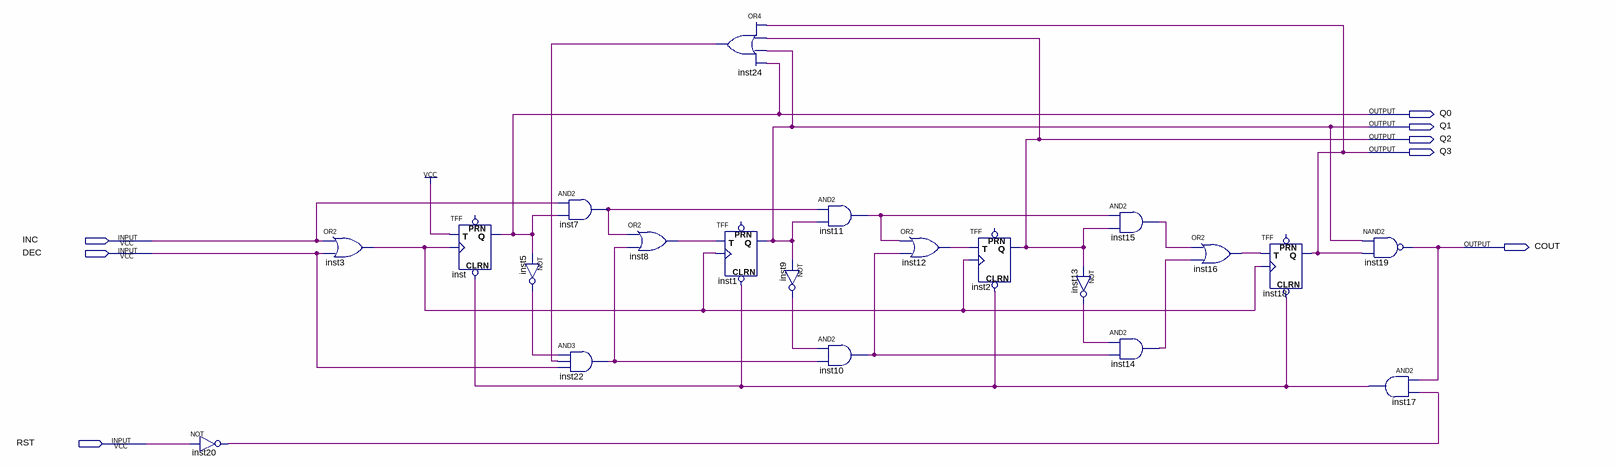
[diagram p0: schematic sheet]
// Quartus schematic up_down.bdf as structural Verilog: 21 symbols, 8 pins
module up_down (
  input  INC,
  input  DEC,
  input  RST,
  output Q0,
  output Q1,
  output Q2,
  output Q3,
  output COUT
);

  wire inst3_out, inst5_out, inst7_out, inst8_out, inst9_out, inst10_out, inst11_out, inst12_out, inst13_out,
       inst14_out, inst15_out, inst16_out, inst17_out, inst20_out, inst22_out, inst24_out;

  not inst20 (inst20_out, RST);
  or inst3 (inst3_out, INC, DEC);
  TFF inst (.CLRN(inst17_out), .T(1'b1), .CLK(inst3_out), .Q(Q0));  // open: PRN
  and inst7 (inst7_out, INC, Q0);
  not inst5 (inst5_out, Q0);
  and inst22 (inst22_out, inst5_out, inst24_out, DEC);
  or inst8 (inst8_out, inst7_out, inst22_out);
  or inst24 (inst24_out, Q3, Q2, Q1, Q0);
  TFF inst1 (.CLRN(inst17_out), .T(inst8_out), .CLK(inst3_out), .Q(Q1));  // open: PRN
  and inst11 (inst11_out, inst7_out, Q1);
  not inst9 (inst9_out, Q1);
  and inst10 (inst10_out, inst9_out, inst22_out);
  or inst12 (inst12_out, inst11_out, inst10_out);
  TFF inst2 (.CLRN(inst17_out), .T(inst12_out), .CLK(inst3_out), .Q(Q2));  // open: PRN
  not inst13 (inst13_out, Q2);
  and inst15 (inst15_out, inst11_out, Q2);
  and inst14 (inst14_out, inst13_out, inst10_out);
  or inst16 (inst16_out, inst15_out, inst14_out);
  TFF inst18 (.CLRN(inst17_out), .T(inst16_out), .CLK(inst3_out), .Q(Q3));  // open: PRN
  nand inst19 (COUT, Q1, Q3);
  and inst17 (inst17_out, COUT, inst20_out);
endmodule
